# EAGLE design adapter (EAGLE 7.3.0)
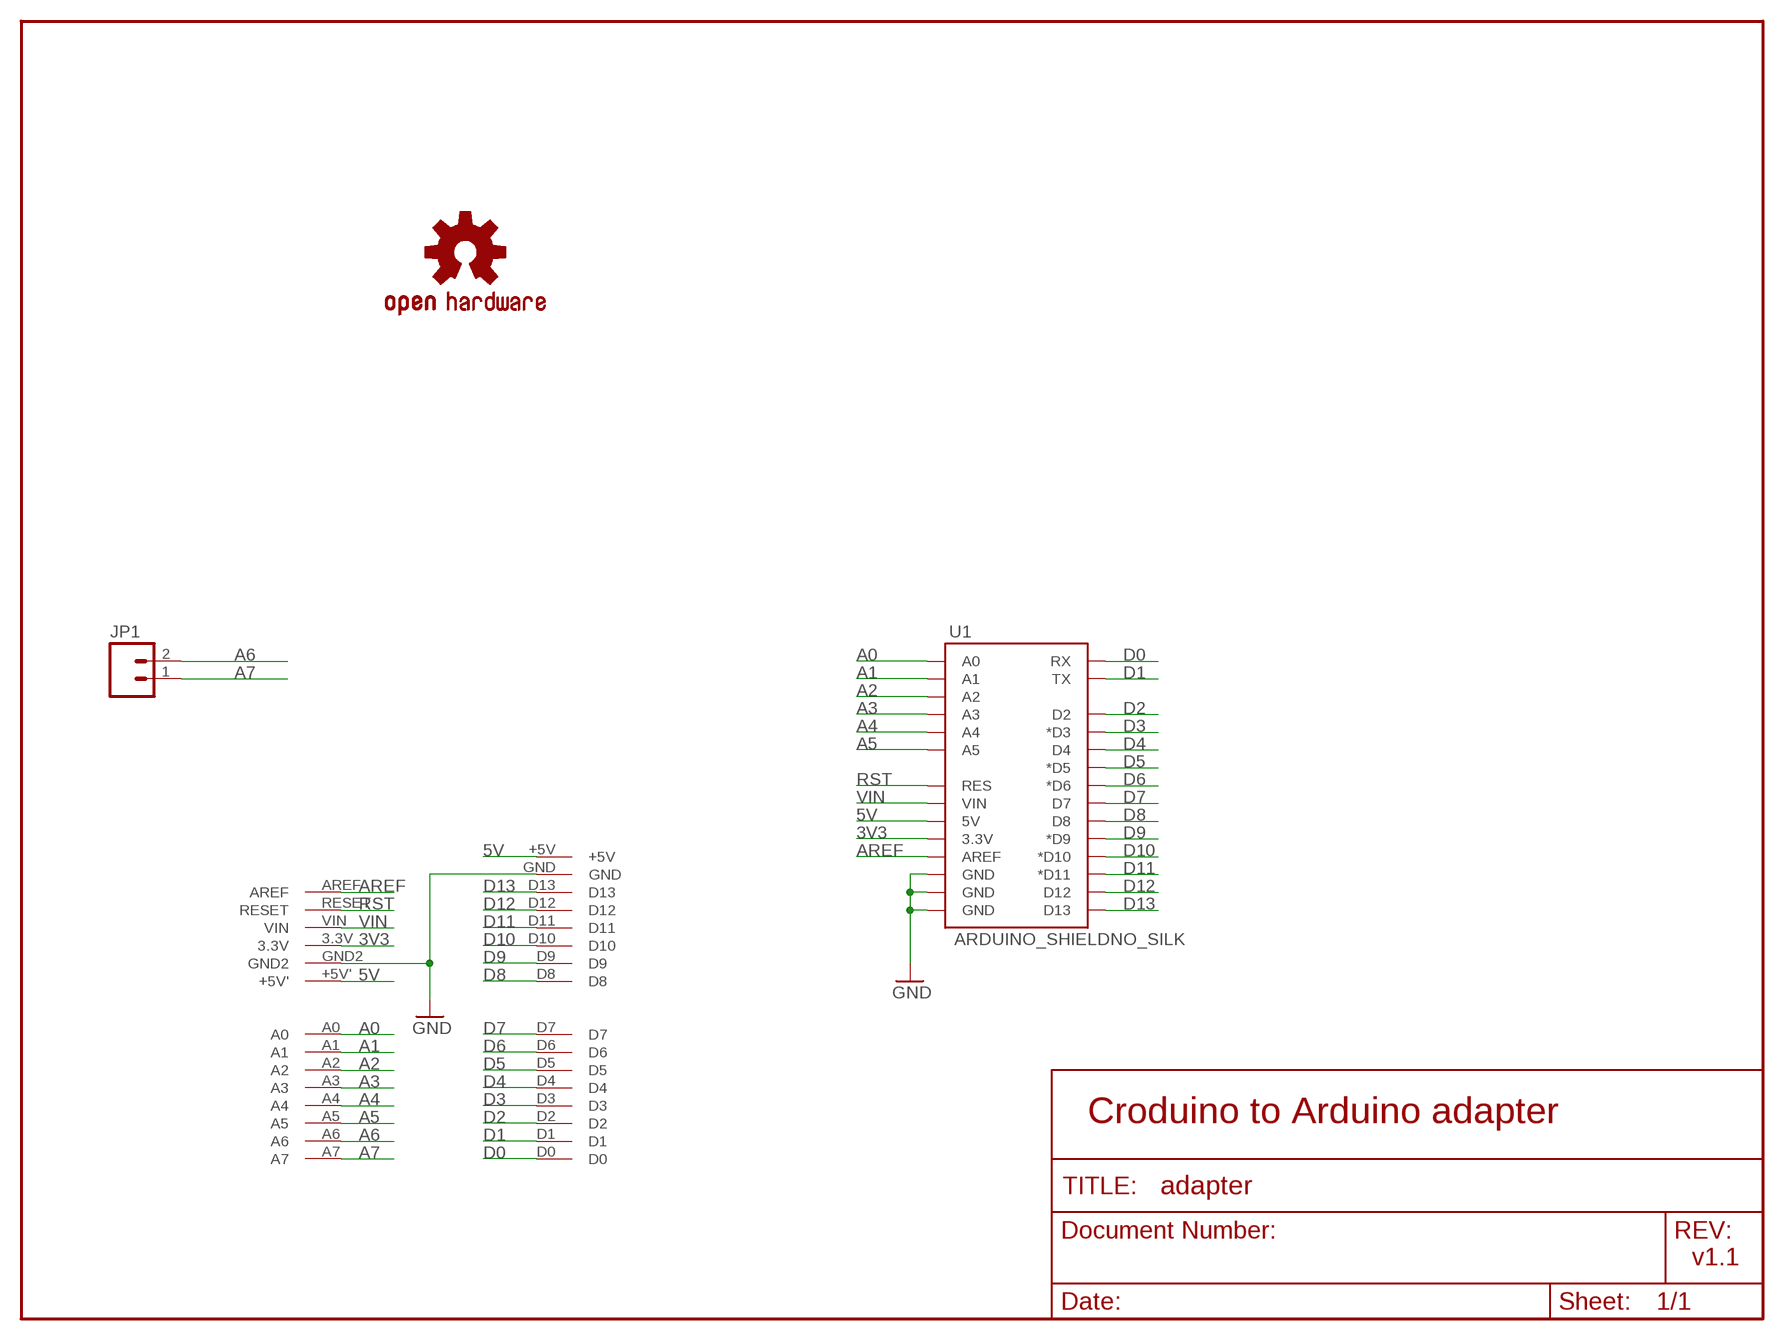
[diagram p0: schematic, sheet 1]

## Parts
JP1  M02LOCK  [1X02_LOCK]
U1  ARDUINO_SHIELDNO_SILK  [DUEMILANOVE_VIAS]
U$1  CRODUINO_FOOTPRINT  [CRODUINO_FOOTPRINT]
U$4  OSHW-LOGOM  [OSHW-LOGO-M]

## Nets
3V3: U1.3.3V U$1.3.3V
5V: U1.5V U$1.+5V U$1.+5V'
A0: U1.A0 U$1.A0
A1: U1.A1 U$1.A1
A2: U1.A2 U$1.A2
A3: U1.A3 U$1.A3
A4: U1.A4 U$1.A4
A5: U1.A5 U$1.A5
A6: JP1.2 U$1.A6
A7: JP1.1 U$1.A7
AREF: U1.AREF U$1.AREF
D0: U1.RX U$1.D0
D1: U1.TX U$1.D1
D2: U1.D2 U$1.D2
D3: U1.D3(*D3) U$1.D3
D4: U1.D4 U$1.D4
D5: U1.D5(*D5) U$1.D5
D6: U1.D6(*D6) U$1.D6
D7: U1.D7 U$1.D7
D8: U1.D8 U$1.D8
D9: U1.D9(*D9) U$1.D9
D10: U1.D10(*D10) U$1.D10
D11: U1.D11(*D11) U$1.D11
D12: U1.D12 U$1.D12
D13: U1.D13 U$1.D13
GND: U1.GND@0(GND) U1.GND@1(GND) U1.GND@2(GND) U$1.GND U$1.GND2
RST: U1.RES U$1.RESET
VIN: U1.VIN U$1.VIN

## Notes on the sheet
- Croduino to Arduino adapter
- v1.1

## Library data of the parts
JP1 = SparkFun:M02: Header 2 Standard 2-pin 0.1" header. Use with straight break away headers (SKU : PRT-00116), right angle break away headers (PRT-00553), swiss pins (PRT-00743), machine pins (PRT-00117), and female headers (PRT-00115). Molex polarized connector foot print use with SKU : PRT-08233 with associated crimp pins and housings.
U1 = SparkFun:ARDUINO_SHIELD
U$1 = ERADIONICA:CRODUINO_FOOTPRINT
U$4 = SparkFun:OSHW-LOGO: Open Source Hardware Logo This logo indicates the piece of hardware it is found on incorporates a OSHW license and/or adheres to the definition of open source hardware found here: http://freedomdefined.org/OSHW

## Board
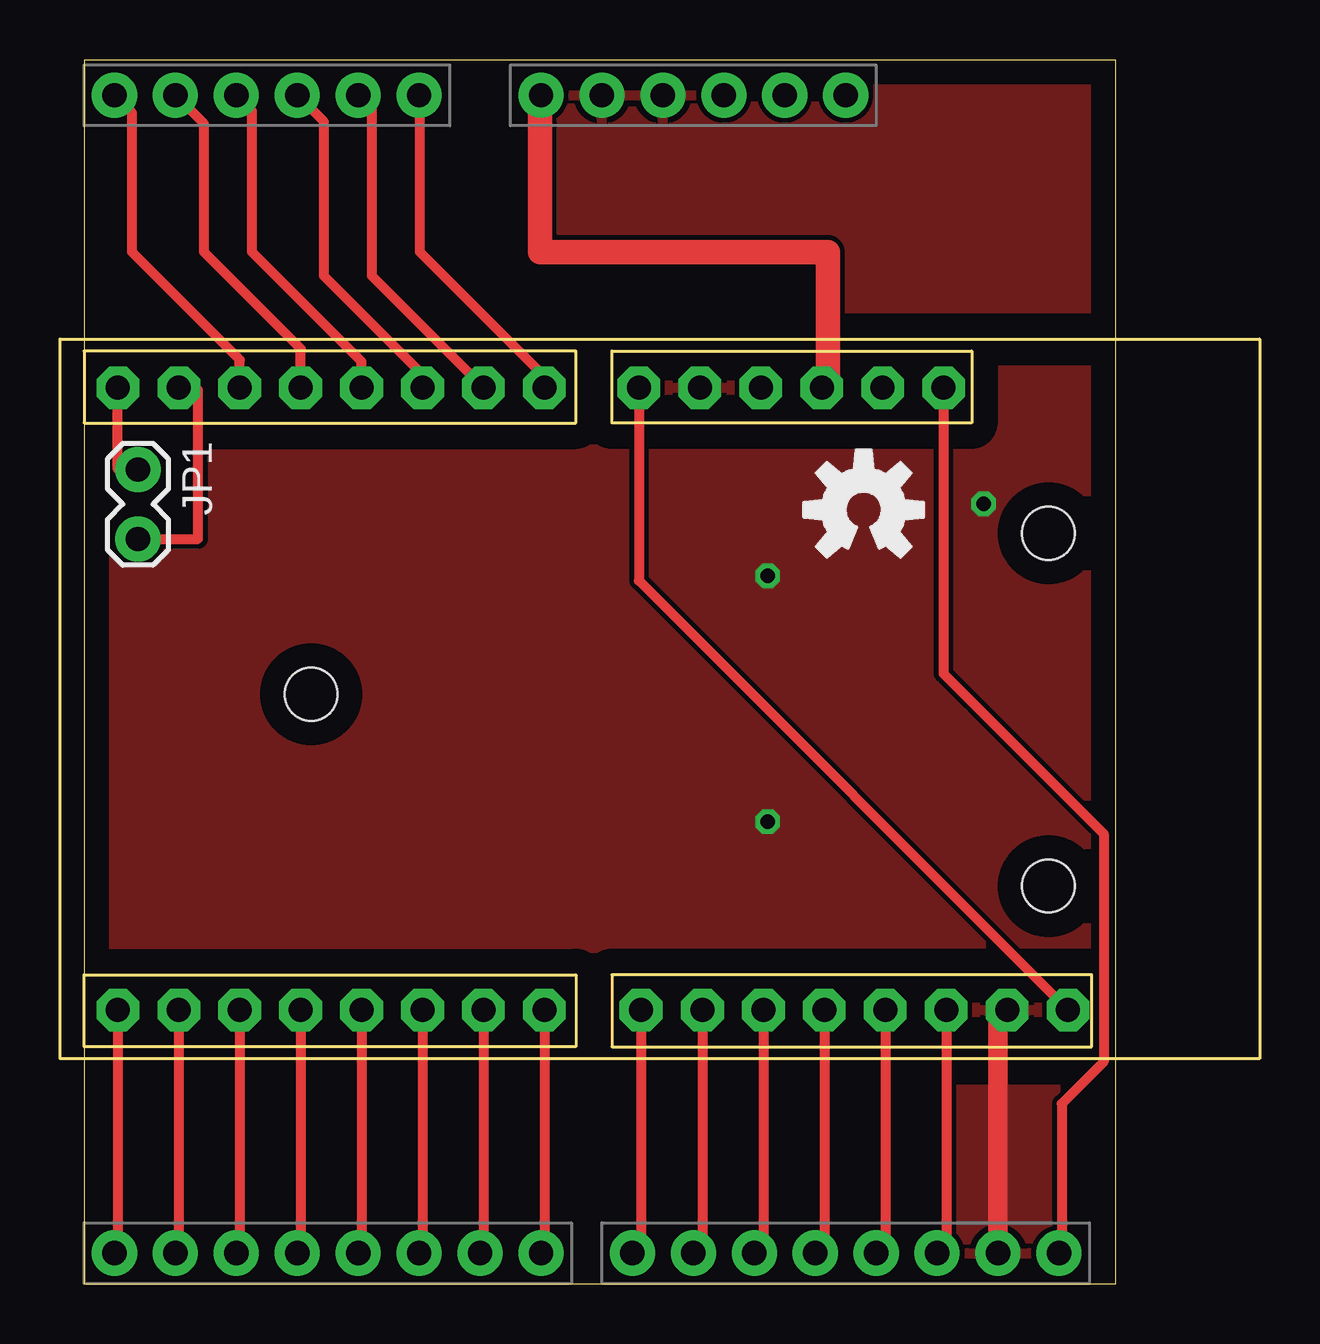
[diagram p1: board, top side]
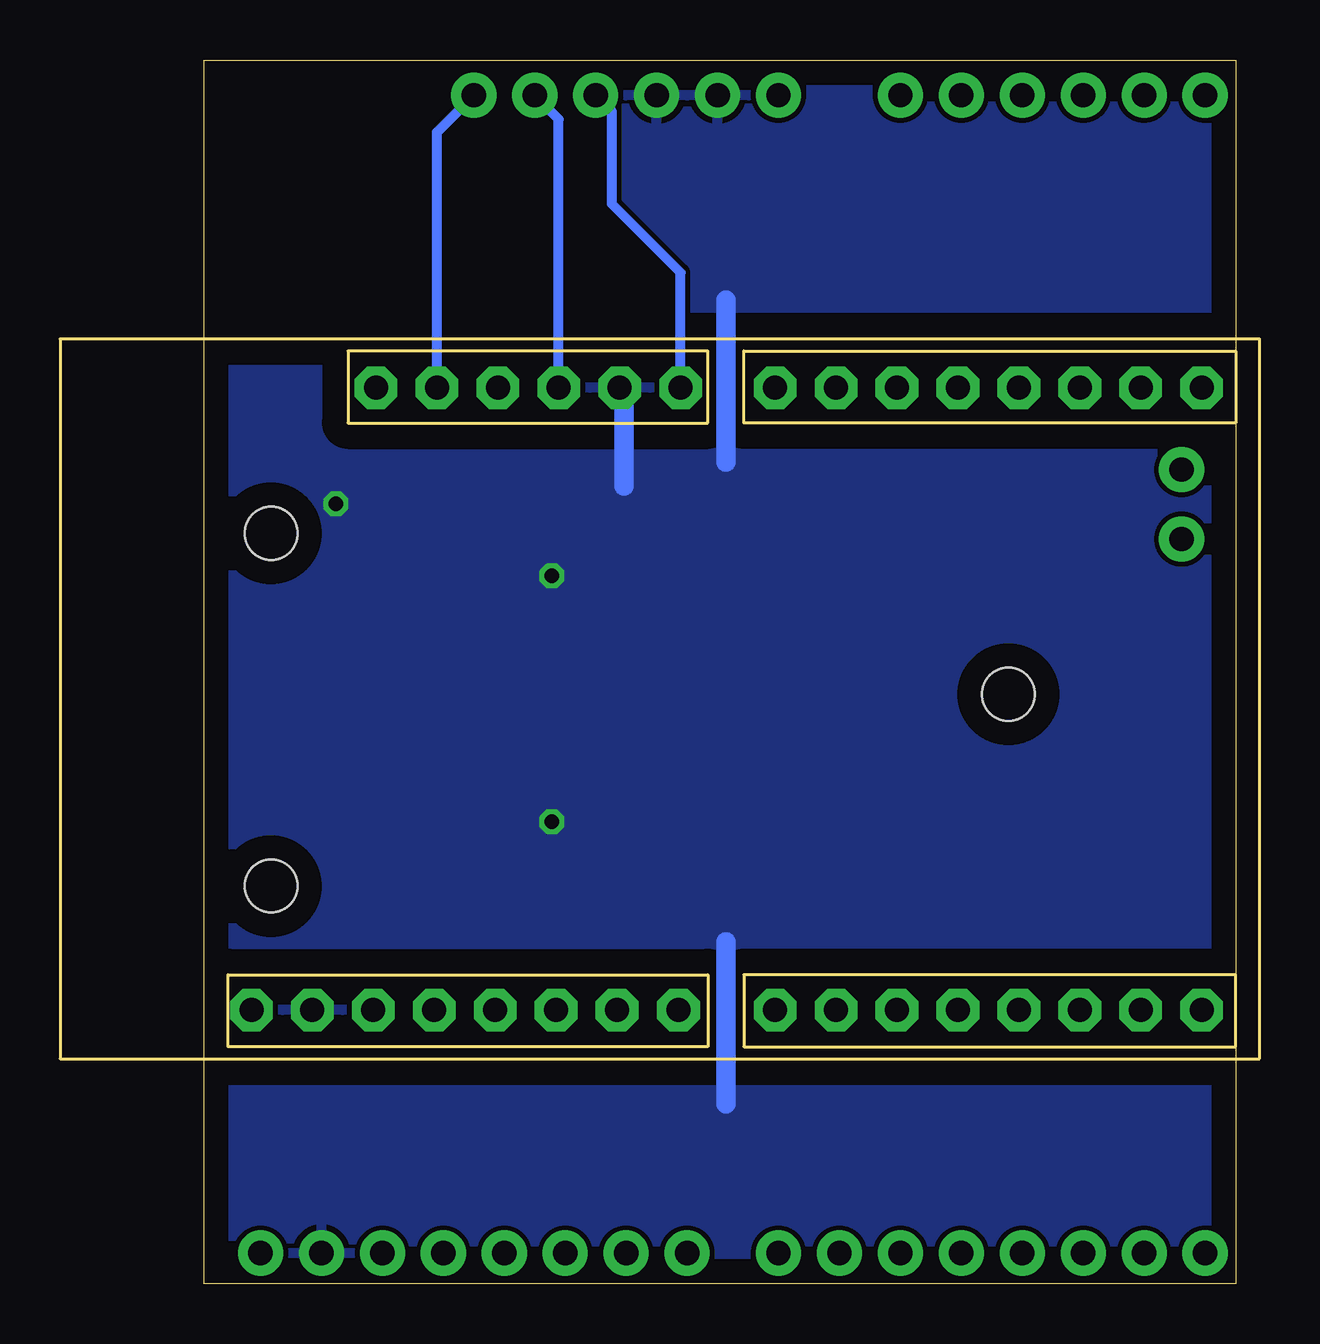
[diagram p2: board, bottom side, seen from below]

Size 43 x 51 mm. Coordinates in mm from the lower left corner, seen from the top.
Outline: 0,0 43,0 43,51 0,51 0,0
Copper layers (1*16): Top 0.035mm / dielectric 1.5mm / Bottom 0.035mm
Design rules "default": minimum track width 10mil, minimum drill 24mil, track to track 8mil, track to pad 8mil, pad to pad 8mil, via to via 8mil, smd to smd 8mil, copper to edge 40mil, drill to drill 8mil, minimum pad ring 10mil, minimum via ring 8mil, stop-mask expansion 4mil, vias tented up to drill 0mil, thermal gap 10mil

### Footprints (pad centres in the part's own frame; a part is rotated, then mirrored left to right if it is on the bottom)
1X02_LOCK = drill 1.016 pad 1.88: 1 -0.178,0; 2 2.718,0
DUEMILANOVE_VIAS = drill 1.016 pad 1.88: 3.3V 50.8,13.97; 5V 50.8,16.51; A0 50.8,29.21; A1 50.8,31.75; A2 50.8,34.29; A3 50.8,36.83; A4 50.8,39.37; A5 50.8,41.91; AREF 2.54,2.54; D2 2.54,36.83; D3 2.54,34.29; D4 2.54,31.75; D5 2.54,29.21; D6 2.54,26.67; D7 2.54,24.13; D8 2.54,20.32; D9 2.54,17.78; D10 2.54,15.24; D11 2.54,12.7; D12 2.54,10.16; D13 2.54,7.62; GND@0 50.8,19.05; GND@1 50.8,21.59; GND@2 2.54,5.08; RES 50.8,11.43; RX 2.54,41.91; TX 2.54,39.37; VIN 50.8,24.13
CRODUINO_FOOTPRINT = drill 1 pad 1.778 octagon: 3.3V 20.79,2.032; +5V 25.87,2.032; +5V' 7.98,27.968; A0 29.808,2.032; A1 32.348,2.032; A2 34.888,2.032; A3 37.428,2.032; A4 39.968,2.032; A5 42.508,2.032; A6 45.048,2.032; A7 47.588,2.032; AREF 13.17,2.032; D0 47.588,27.968; D1 45.048,27.968; D2 42.508,27.968; D3 39.968,27.968; D4 37.428,27.968; D5 34.888,27.968; D6 32.348,27.968; D7 29.808,27.968; D8 25.78,27.968; D9 23.22,27.968; D10 20.68,27.968; D11 18.14,27.968; D12 15.6,27.968; D13 13.06,27.968; GND 23.33,2.032; GND2 10.52,27.968; RESET 15.71,2.032; VIN 18.25,2.032 | hole 2.2: 8.8,8.1; 8.8,22.8; 39.53,14.81

### Placement (x,y rotation side)
JP1  2.25,33.75 270 top
U1  43.18,-1.27 90 top
U$1  49,39.37 180 top
U$2  [UTICNICA3MM]  34.75,26.25 0 top
U$3  [MADE-IN-CROATIA]  4.75,14.5 0 top
U$4  32.5,32.25 0 top
U$5  [OSH3MM]  38.5,26.25 0 top

### Tracks (layer width: path | path; a pad name or v marks a point on that pad's centre or on a via)
3V3
  Bottom 0.406: U$1.3.3V 28.21,48.53 U1.3.3V
5V
  Top 0.406: U$1.+5V 23.13,29.29 U$1.+5V'
  Bottom 0.406: U$1.+5V 23.13,42.13 26,45 26,48.86 U1.5V
A0
  Top 0.406: U$1.A0 19.19,37.81 14,43 14,49.5 U1.A0
A1
  Top 0.406: U$1.A1 12,42 12,48.96 U1.A1
A2
  Top 0.406: U$1.A2 14.11,37.89 10,42 10,48.42 U1.A2
A3
  Top 0.406: U$1.A3 11.57,38.43 7,43 7,48.88 U1.A3
A4
  Top 0.406: U$1.A4 9.03,38.97 5,43 5,48.34 U1.A4
A5
  Top 0.406: U$1.A5 6.49,38.51 2,43 2,48.8 U1.A5
A6
  Top 0.406: JP1.2 4.75,31.03 4.75,37.25 3.95,37.25 U$1.A6
A7
  Top 0.406: JP1.1 1.41,33.93 U$1.A7
AREF
  Top 0.406: U$1.AREF 35.83,25.42 42.5,18.75 42.5,9.25 40.75,7.5 40.75,1.38 U1.AREF
D0
  Top 0.406: U$1.D0 1.41,1.41 U1.RX
D1
  Top 0.406: U$1.D1 3.95,1.41 U1.TX
D2
  Top 0.406: U$1.D2 6.49,1.41 U1.D2
D3
  Top 0.406: U$1.D3 9.03,1.41 U1.D3
D4
  Top 0.406: U$1.D4 11.57,1.41 U1.D4
D5
  Top 0.406: U$1.D5 14.11,1.41 U1.D5
D6
  Top 0.406: U$1.D6 16.65,1.41 U1.D6
D7
  Top 0.406: U$1.D7 19.19,1.41 U1.D7
D8
  Top 0.406: U$1.D8 23.22,1.63 U1.D8
D9
  Top 0.406: U$1.D9 25.78,1.65 U1.D9
D10
  Top 0.406: U$1.D10 28.32,1.65 U1.D10
D11
  Top 0.406: U$1.D11 30.86,1.65 U1.D11
D12
  Top 0.406: U$1.D12 33.4,1.65 U1.D12
D13
  Top 0.406: U$1.D13 35.94,1.65 U1.D13
GND  (via drill 0.6)
  Top 0.813: U$1.GND2 38.1,11.4 U1.GND@2
  Bottom 0.813: 21.25,41 21.25,34.25 | 21.25,14.25 21.25,7.5 | U$1.GND 25.5,37.34 25.5,33.25
  other vias: 28.5,19.25 28.5,29.5 37.5,32.5
  pour Bottom: 0,0 0,51 43,51 43,0
  pour Top: 0,0 0,51 43,51 43,0
RST
  Bottom 0.406: U$1.RESET 33.29,47.99 U1.RES
VIN
  Top 1.016: U$1.VIN 31,37.34 31,43 19,43 19,49.48 U1.VIN

### Text on the board
bStop: e-radionica.com
200bmp: 5 | 4 | 3 | 2 | 1 | 0 | Analog | vin | gnd | gnd | +5V | 3V3 | rst | A7 | A6 | Croduino to Arduino | adapter | PWM | PWM | PWM | PWM | PWM | PWM | 0 | 1 | 2 | 3 | 4 | 5 | 6 | 7 | 8 | 9 | 10 | 11 | 12 | 13 | gnd | aref
208bmp: e-radionica.com